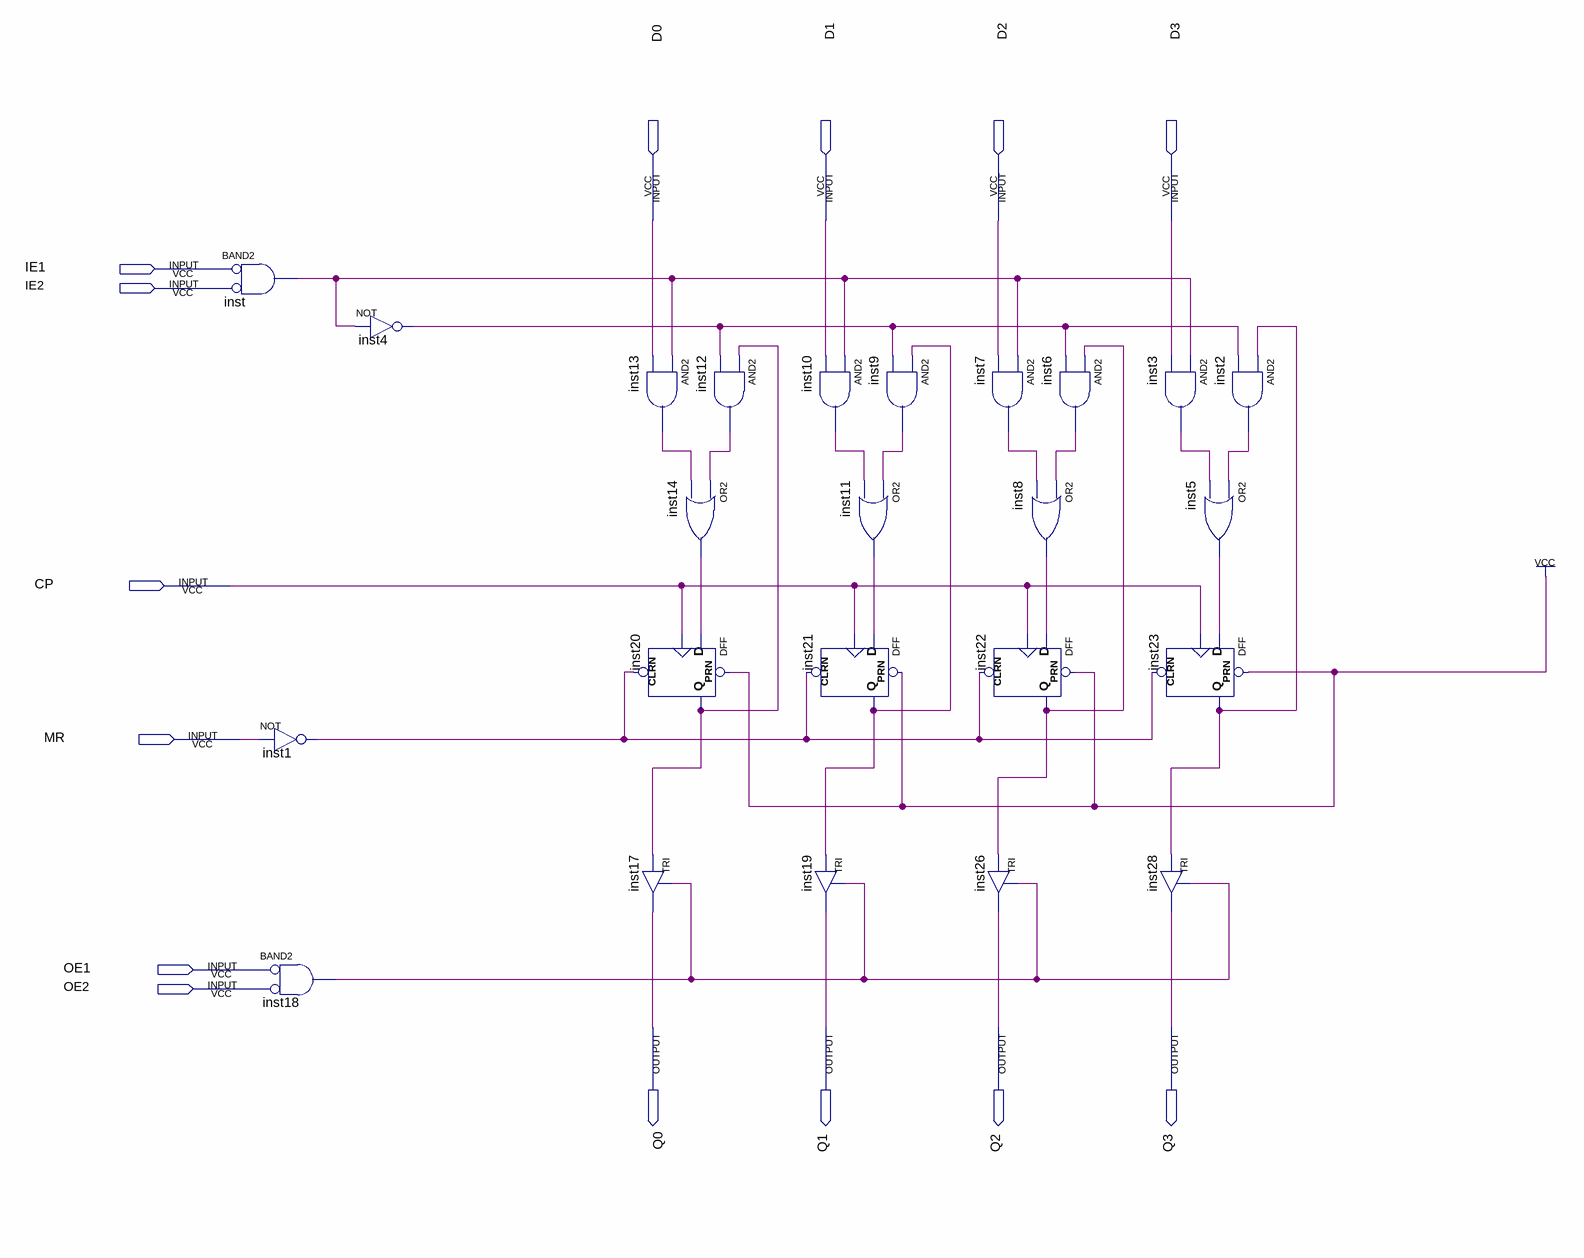
[diagram p0: schematic sheet]
// Quartus schematic ALP74LS173.bdf as structural Verilog: 24 symbols, 14 pins
module ALP74LS173 (
  input  D0,
  input  D1,
  input  D2,
  input  D3,
  input  IE1,
  input  IE2,
  input  CP,
  input  MR,
  input  OE1,
  input  OE2,
  output Q0,
  output Q1,
  output Q2,
  output Q3
);

  wire inst1_out, inst2_out, inst3_out, inst4_out, inst5_out, inst6_out, inst7_out, inst8_out, inst9_out,
       inst10_out, inst11_out, inst12_out, inst13_out, inst14_out, inst18_out, inst20_q, inst21_q, inst22_q,
       inst23_q, inst_out;

  and inst (inst_out, ~IE1, ~IE2);  // BAND2
  not inst1 (inst1_out, MR);
  and inst18 (inst18_out, ~OE1, ~OE2);  // BAND2
  not inst4 (inst4_out, inst_out);
  and inst13 (inst13_out, inst_out, D0);
  or inst14 (inst14_out, inst12_out, inst13_out);
  DFF inst20 (.CLRN(inst1_out), .CLK(CP), .D(inst14_out), .PRN(1'b1), .Q(inst20_q));
  TRI inst17 (.IN(inst20_q), .OE(inst18_out), .OUT(Q0));
  and inst12 (inst12_out, inst20_q, inst4_out);
  and inst10 (inst10_out, inst_out, D1);
  DFF inst21 (.CLRN(inst1_out), .CLK(CP), .D(inst11_out), .PRN(1'b1), .Q(inst21_q));
  TRI inst19 (.IN(inst21_q), .OE(inst18_out), .OUT(Q1));
  and inst9 (inst9_out, inst21_q, inst4_out);
  or inst11 (inst11_out, inst9_out, inst10_out);
  and inst7 (inst7_out, inst_out, D2);
  DFF inst22 (.CLRN(inst1_out), .CLK(CP), .D(inst8_out), .PRN(1'b1), .Q(inst22_q));
  TRI inst26 (.IN(inst22_q), .OE(inst18_out), .OUT(Q2));
  and inst6 (inst6_out, inst22_q, inst4_out);
  or inst8 (inst8_out, inst6_out, inst7_out);
  and inst3 (inst3_out, inst_out, D3);
  or inst5 (inst5_out, inst2_out, inst3_out);
  DFF inst23 (.CLRN(inst1_out), .CLK(CP), .D(inst5_out), .PRN(1'b1), .Q(inst23_q));
  TRI inst28 (.IN(inst23_q), .OE(inst18_out), .OUT(Q3));
  and inst2 (inst2_out, inst23_q, inst4_out);
endmodule
